# EasyEDA schematic SCH_LED_drill_2025-12-12.json
TITLE: GW_LED_Drill (https://alexgyver.ru/drill-pid/ ); REV: 1.0; Date: 2025-10-14; Sheet: 1/1; Drawn By: Kiti777; Company: V0
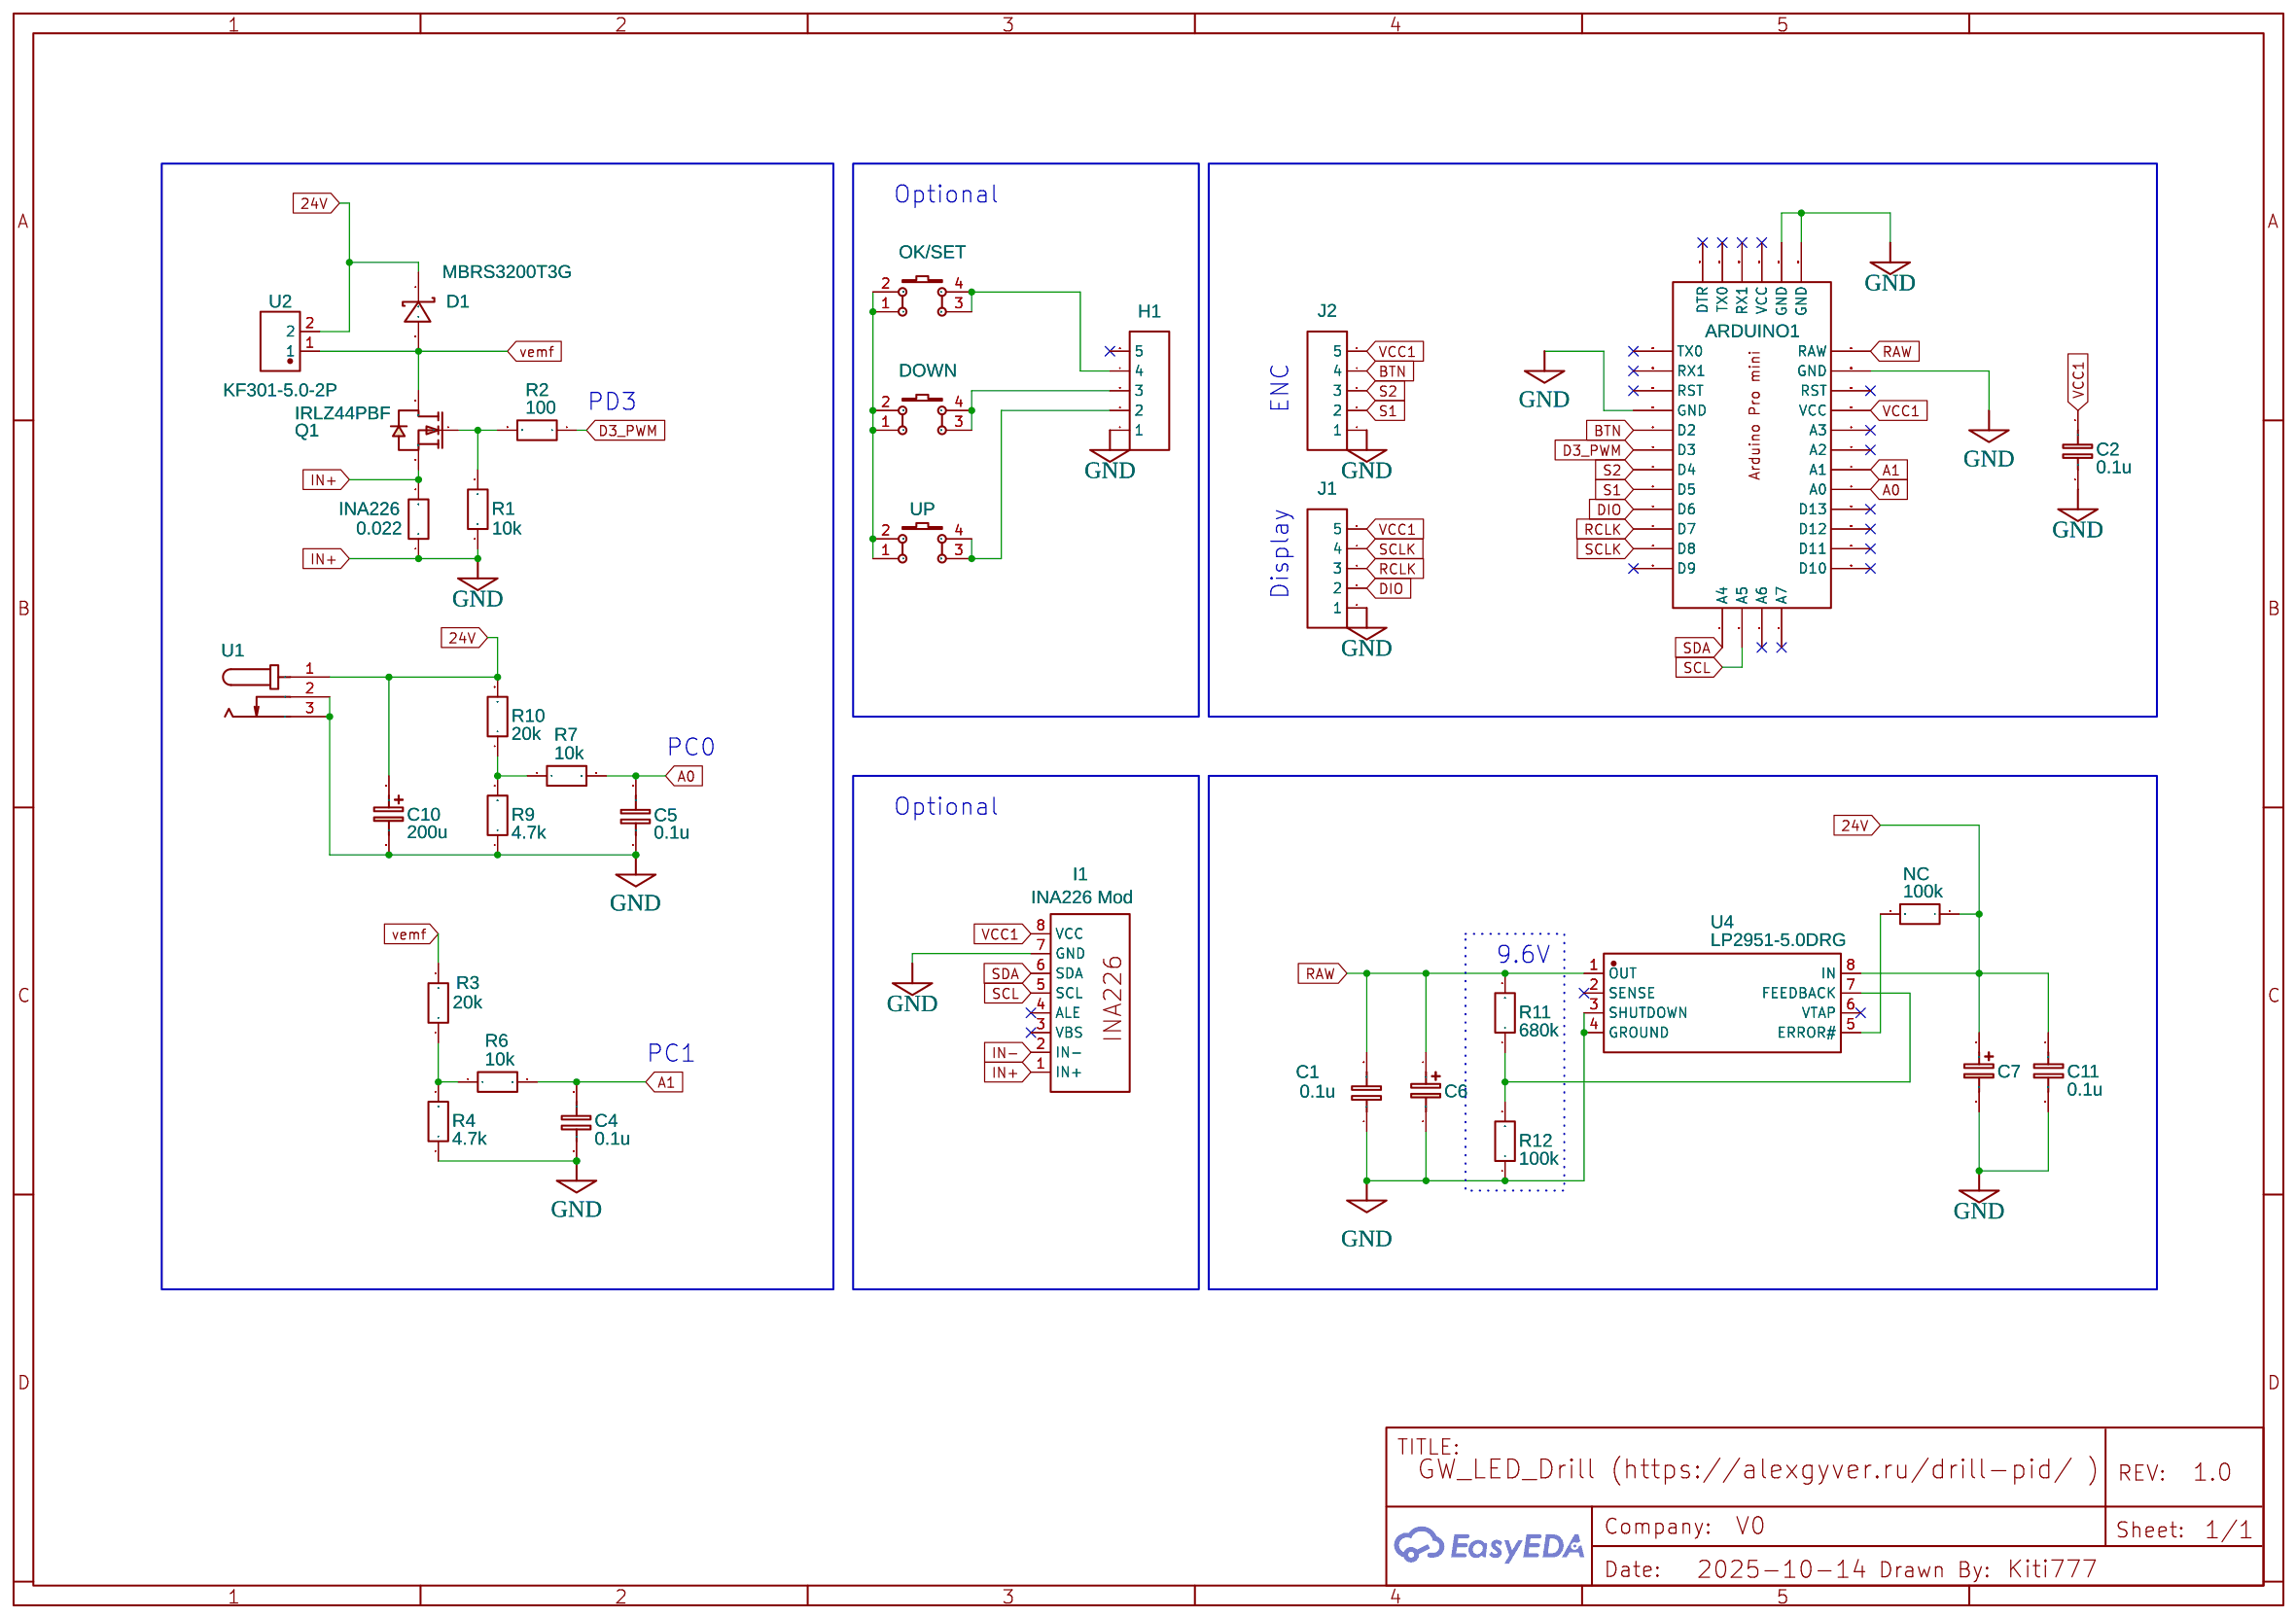
[diagram p0: schematic sheet]

## Parts
ARDUINO1  ARDUINO PRO MINI  [ARDUINOPROMINI_ARDUINO_PRO_MINI]
C1  0.1u  [C1206]
C2  0.1u  [C0805]
C4  0.1u  [C0805]
C5  0.1u  [C0805]
C6  TANTALUM SMT CAPACITOR 330UF C  [CAP-SMD_L6.0-W3.2-FD-A]
C7  TANTALUM SMT CAPACITOR 330UF C  [CAP-SMD_L6.0-W3.2-FD-A]
C10  200u  [CAP-D6.3-F2.5]
C11  0.1u  [C1206]
D1  MBRS3200T3G  [SMB_L4.6-W3.6-LS5.3-RD]
DOWN  K4-6×6_TH  [KEY-TH_4P-L6.0-W6.0-P4.50-LS6.5]
H1  HDR-F-2.54_1x5  [HDR-F-2.54_1X5]
I1  INA226 Mod  [INA226_1]
INA226  0.022  [R2010]
J1  HDR-M-2.54_1x5  [HDR-M-2.54_1X5]
J2  HDR-M-2.54_1x5  [HDR-M-2.54_1X5]
NC  100k  [R0805]
OK/SET  K4-6×6_TH  [KEY-TH_4P-L6.0-W6.0-P4.50-LS6.5]
Q1  IRLZ44PBF  [TO-220AB-3_L10.4-W4.6-P2.54-L]
R1  10k  [R1206]
R2  100  [R1206]
R3  20k  [R1206]
R4  4.7k  [R1206]
R6  10k  [R1206]
R7  10k  [R1206]
R9  4.7k  [R1206]
R10  20k  [R1206]
R11  680k  [R0805]
R12  100k  [R0805]
U1  ZX-DC-WC26.4  [DC-TH_ZX-DC-WC2.56.3]
U2  KF301-5.0-2P  [CONN-TH_P5.00_KF301-5.0-2P]
U4  LP2951-5.0DRG  [SOP-8_L4.9-W3.9-P1.27-LS6.0-BL]
UP  K4-6×6_TH  [KEY-TH_4P-L6.0-W6.0-P4.50-LS6.5]

## Library data of the parts
ARDUINO1 = ARDUINO PRO MINI: Contributor: tapkodaf
C1 C5 C11 = C_1206_EU: Contributor: LCEDA_Lib
C2 C4 = C_0805_EU: Contributor: LCEDA_Lib
C6 C7 = TANTALUM SMT CAPACITOR 330UF C: Contributor: LCSC; Supplier: LCSC; Supplier Part: C9900006421; Manufacturer Part: Tantalum SMT Capacitor 330uF C; JLCPCB Part Class: Extended Part
C10 = CE_SMD_D8.0×H10.5_EU: Contributor: LCEDA_Lib
D1 = MBRS3200T3G: Contributor: LCSC; Supplier Part: C86674; Supplier: LCSC; Manufacturer: onsemi(安森美); JLCPCB Part Class: Extended Part
DOWN OK/SET UP = K4-6×6_TH: Supplier: LCSC; Supplier Part: C136684; Manufacturer: 韩国韩荣; Manufacturer Part: K2-1102DP-E4SW-04; Contributor: LCEDA_Lib
H1 = HDR-F-2.54_1x5: Supplier Part: C50950; Supplier: LCSC; Contributor: LCEDA_Lib
I1 = INA226_1 Modulo: link: nivaldog43@gmail.com; Contributor: Nivaldo Guardiano
INA226 = R_2010_EU: Contributor: LCEDA_Lib
J1 J2 = HDR-M-2.54_1x5: Supplier Part: C358687; Supplier: LCSC; Contributor: LCEDA_Lib
NC R11 R12 = R_0805_EU: Contributor: LCEDA_Lib
Q1 = IRLZ44PBF: Contributor: LCSC; Supplier: LCSC; Supplier Part: C2680731; Manufacturer: VBsemi(微碧半导体); Manufacturer Part: IRLZ44PBF-VB; JLCPCB Part Class: Extended Part
R1-R4 R6 R7 R9 R10 = R_1206_EU: Contributor: LCEDA_Lib
U1 = ZX-DC-WC26.4: Contributor: lcsc; Supplier: LCSC; Supplier Part: C7419922; Manufacturer: Megastar(兆星); JLCPCB Part Class: Extended Part
U2 = KF301-5.0-2P: Contributor: LCSC; Supplier: LCSC; Supplier Part: C474881; Manufacturer: KEFA(科发); JLCPCB Part Class: Extended Part
U4 = LP2951-5.0DRG: Supplier: LCSC; Supplier Part: C5145250; Manufacturer: HGC(深圳汉芯); JLCPCB Part Class: Extended Part; Contributor: lcsc

## Nets
24V: C7.1 C10.1 C11.1 D1.1(C) NC.1 R10.2 U1.1 U2.2 U4.8(IN)
GND: ARDUINO1.GND@0(GND) ARDUINO1.GND@1(GND) ARDUINO1.GND@2(GND) ARDUINO1.GND@3(GND) C1.1 C2.1 C4.1 C5.1 C6.2 C7.2 C10.2 C11.2 H1.1 I1.1(IN+) I1.7(GND) INA226.1 INA226.2 J1.1 J2.1 Q1.3(S) R1.1 R4.1 R9.1 R12.1 U1.2 U1.3 U4.3(SHUTDOWN) U4.4(GROUND)
VCC1: ARDUINO1.VCC@1(VCC) C2.2 I1.8(VCC) J1.5 J2.5
A0: ARDUINO1.A0 C5.2 R7.2
A1: ARDUINO1.A1 C4.2 R6.2
BTN: ARDUINO1.D2 J2.4
D3_PWM: ARDUINO1.D3 R2.1
DIO: ARDUINO1.D6 J1.2
IN-: I1.2(IN-)
RAW: ARDUINO1.RAW C1.2 C6.1 R11.2 U4.1(OUT)
RCLK: ARDUINO1.D7 J1.3
S1: ARDUINO1.D5 J2.2
S2: ARDUINO1.D4 J2.3
SCL: ARDUINO1.A5 I1.5(SCL)
SCLK: ARDUINO1.D8 J1.4
SDA: ARDUINO1.A4 I1.6(SDA)
vemf: D1.2(A) Q1.2(D) R3.2 U2.1
Net-(DOWN-1): DOWN.1 DOWN.2 OK/SET.1 OK/SET.2 UP.1 UP.2
Net-(DOWN-3): DOWN.3 DOWN.4 H1.3
Net-(H1-2): H1.2 UP.3 UP.4
Net-(H1-4): H1.4 OK/SET.3 OK/SET.4
Net-(NC-2): NC.2 U4.5(ERROR#)
Net-(Q1-1): Q1.1(G) R1.2 R2.2
Net-(R3-1): R3.1 R4.2 R6.1
Net-(R7-1): R7.1 R9.2 R10.1
Net-(R11-1): R11.1 R12.2 U4.7(FEEDBACK)

Not connected (* = marked no-connect by the designer): ARDUINO1 A2* A3* A6* A7* D9* D10* D11* D12* D13* DTR* RST@0(RST)* RST@1(RST)* RX1@0(RX1)* RX1@1(RX1)* TX0@0(TX0)* TX0@1(TX0)* VCC@0(VCC)*; H1 5*; I1 3(VBS)* 4(ALE)*; U4 2(SENSE)* 6(VTAP)*

## Notes on the sheet
- Optional
- PD3
- ENC
- Display
- PC0
- Optional
- 9.6V
- PC1
